# Altium schematic sheet [03] - CPU.SchDoc: Desk Digital Clock
size A4; DrawnBy: Ramil Teregulov; Address1: https://github.com/teregulov; Address2: https://github.com/teregulov/Desk-Digital-Clock; DocumentNumber: DDC-2; Revision: 1R0; SheetNumber: 2; SheetTotal: 7
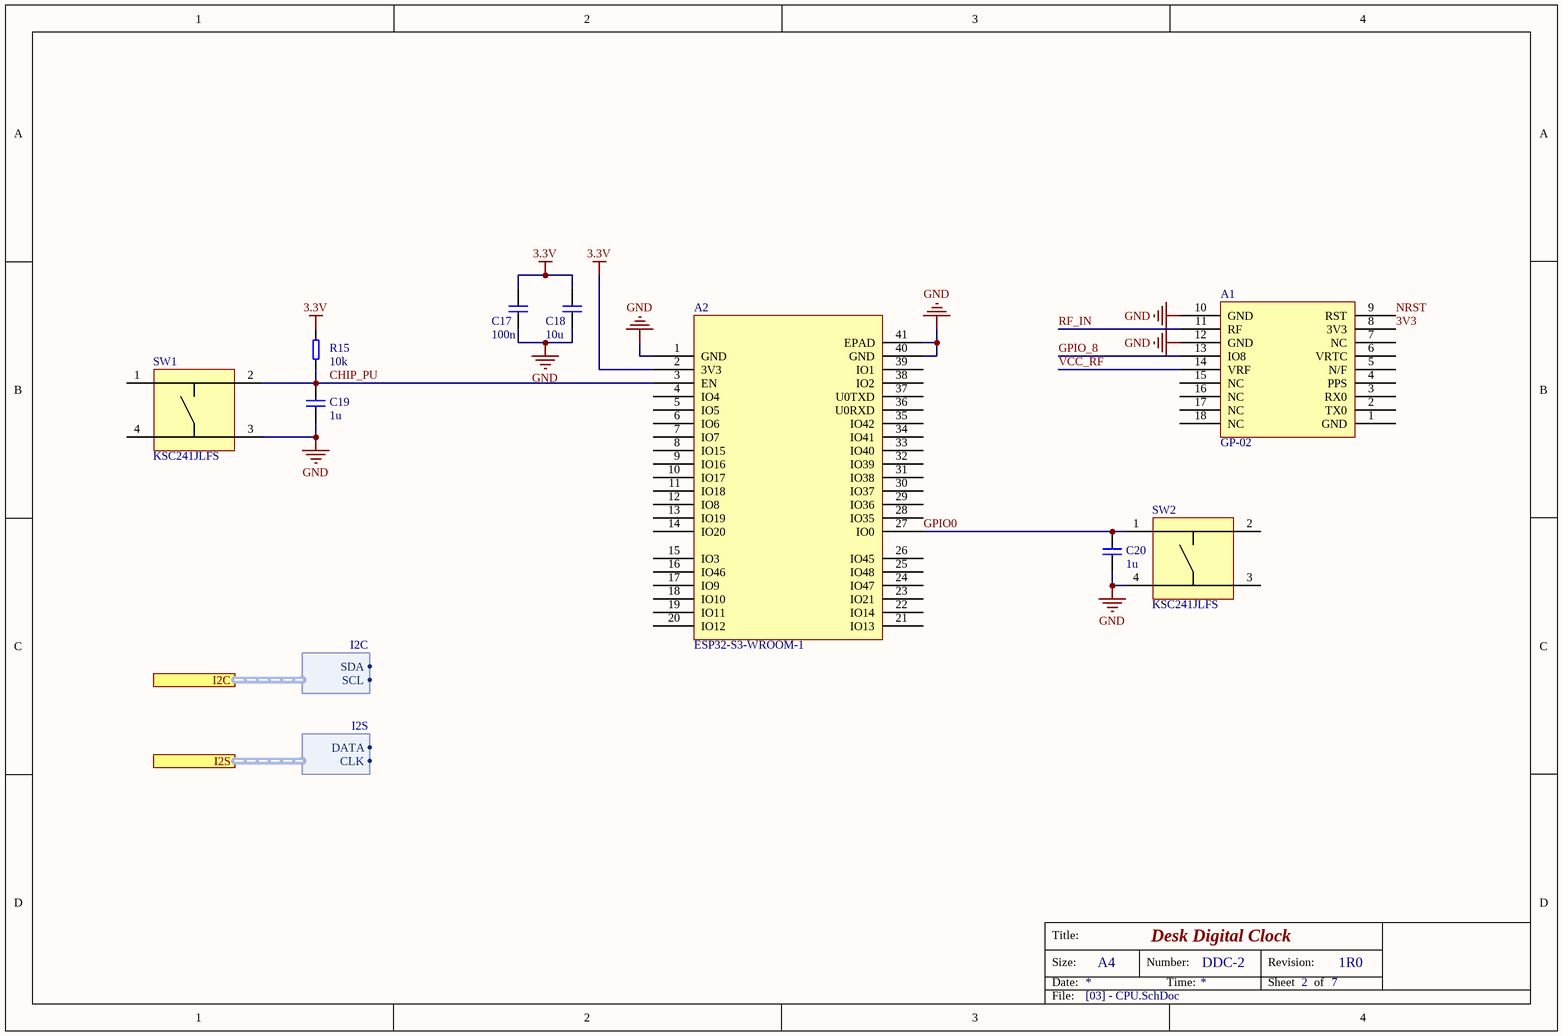
[diagram p0: [03] - CPU.SchDoc]

## Parts
A1  GP-02  [GP-02]
A2  ESP32-S3-WROOM-1  [ESP32-S3-WROOM-1]
C17  100n  [C0603]
C18  10u  [C0603]
C19  1u  [C0603]
C20  1u  [C0603]
R15  10k  [R0603]
SW1  KSC241JLFS  [KSC241JLFS]
SW2  KSC241JLFS  [KSC241JLFS]

## Ports
I2C (harness I2C), I2S (harness I2S)

## Harnesses
I2C: SDA, SCL
I2S: DATA, CLK

## Nets
3.3V: A2.2(3V3) C17.1 C18.1 R15.2
GND: A1.10(GND) A1.12(GND) A2.1(GND) A2.40(GND) A2.41(EPAD) C17.2 C18.2 C19.2 C20.2 SW1.3 SW2.4
3V3: A1.8(3V3)
CHIP_PU: A2.3(EN) C19.1 R15.1 SW1.2
GPIO0: A2.27(IO0) C20.1 SW2.1
GPIO_8: A1.13(IO8)
NRST: A1.9(RST)
RF_IN: A1.11(RF)
VCC_RF: A1.14(VRF)

Not connected (* = marked no-connect by the designer): A1 1(GND) 2(TX0) 3(RX0) 4(PPS) 5(N/F) 6(VRTC) 7(NC) 15(NC) 16(NC) 17(NC) 18(NC); A2 4(IO4) 5(IO5) 6(IO6) 7(IO7) 8(IO15) 9(IO16) 10(IO17) 11(IO18) 12(IO8) 13(IO19) 14(IO20) 15(IO3) 16(IO46) 17(IO9) 18(IO10) 19(IO11) 20(IO12) 21(IO13) 22(IO14) 23(IO21) 24(IO47) 25(IO48) 26(IO45) 28(IO35) 29(IO36) 30(IO37) 31(IO38) 32(IO39) 33(IO40) 34(IO41) 35(IO42) 36(U0RXD) 37(U0TXD) 38(IO2) 39(IO1); SW1 1 4; SW2 2 3

## Notes on the sheet
- Title:
- Size:
- Date:
- A4
- Number:
- Time:
- Revision:
- Sheet
- of
- File:

## Library data of the parts
A1 = GP-02: high-performance BDS/GNSS multi-mode satellite navigation receiver SOCmodule; Manufacturer: Ai Thinker; Datasheet: https://aithinker-static.oss-cn-shenzhen.aliyuncs.com/docs/_media_old/gp-02_specification.pdf; P/N: GP-02
A2 = ESP32-S3-WROOM-1: 2.4 GHz Wi-Fi (802.11 b/g/n) and Bluetooth® 5 (LE) module; Manufacturer: espressif; Datasheet: https://www.espressif.com/sites/default/files/documentation/esp32-s3-wroom-1_wroom-1u_datasheet_en.pdf; P/N: ESP32-S3-WROOM-1
C17-C20 = Cap: CAPACITOR
  C17: Value: 100n
  C18: Value: 10u
  C19 C20: Value: 1u
R15 = Res: RESISTOR; Value: 10k
SW1 SW2 = KSC241JLFS: SWITCH TACTILE SPST-NO 50mA @ 32VDC; Manufacturer: C&K; P/N: KSC241JLFS; Datasheet: https://www.ckswitches.com/media/1968/ksc2.pdf